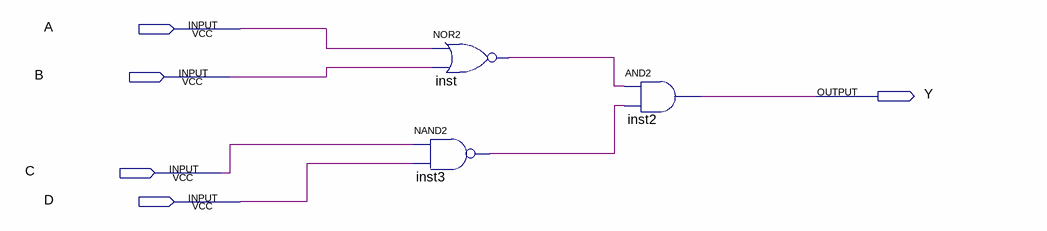
[diagram p0: schematic sheet]
// Quartus schematic lab_1.bdf as structural Verilog: 3 symbols, 5 pins
module lab_1 (
  input  A,
  input  B,
  input  C,
  input  D,
  output Y
);

  wire inst3_out, inst_out;

  nor inst (inst_out, A, B);
  nand inst3 (inst3_out, C, D);
  and inst2 (Y, inst_out, inst3_out);
endmodule
